# EAGLE board PART1 (EAGLE 9.6.2)
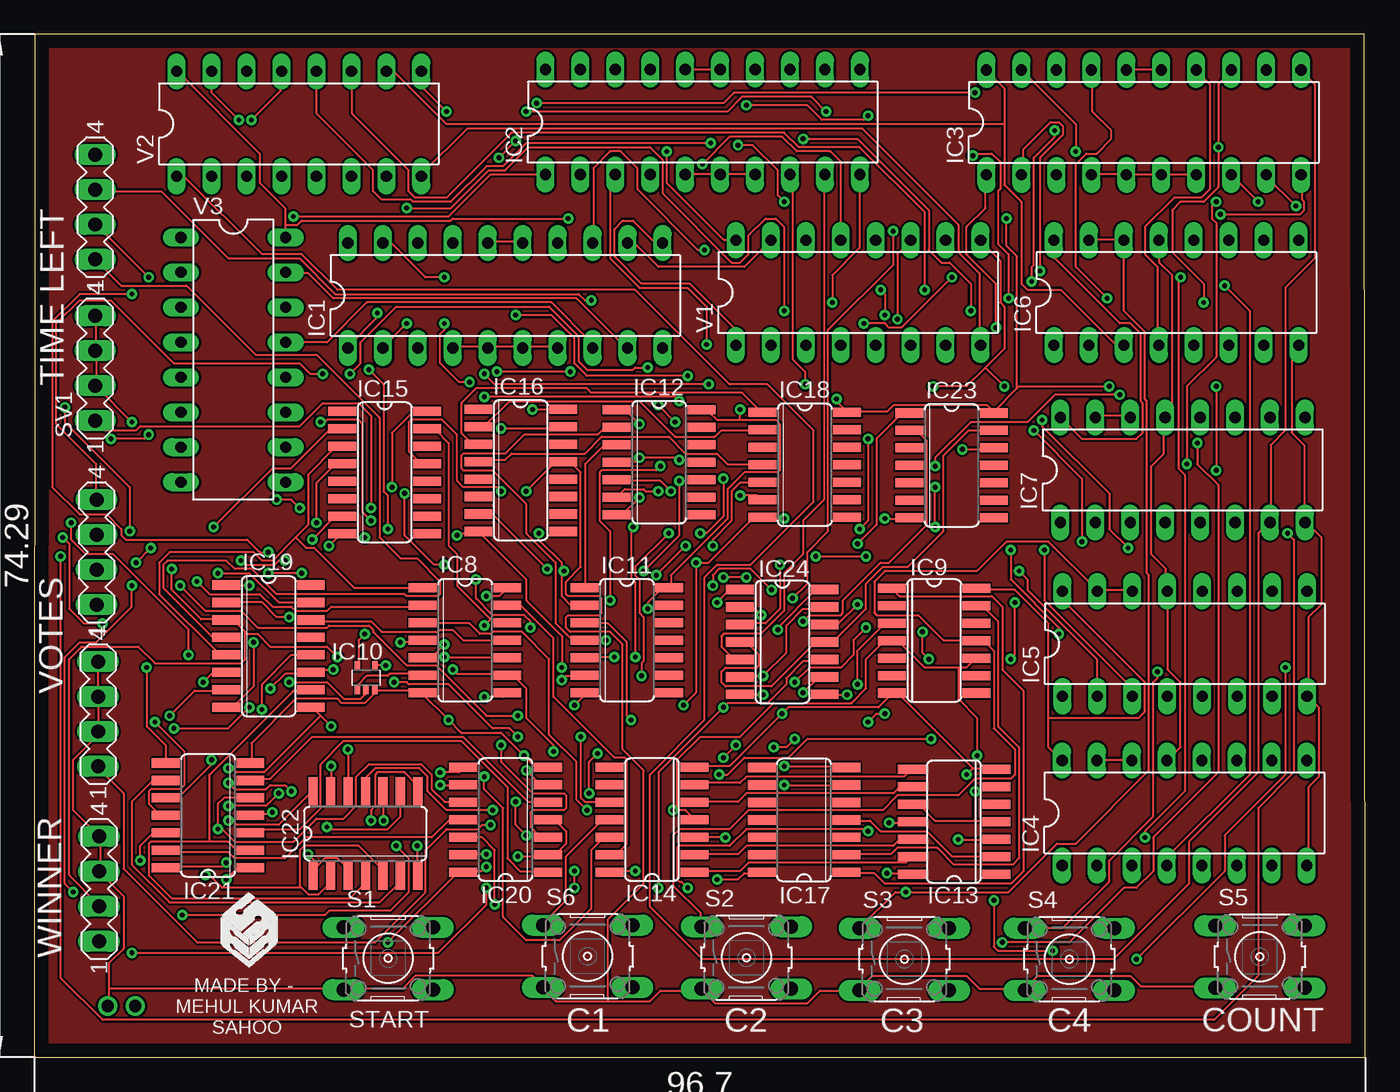
[diagram p1: board, top side]
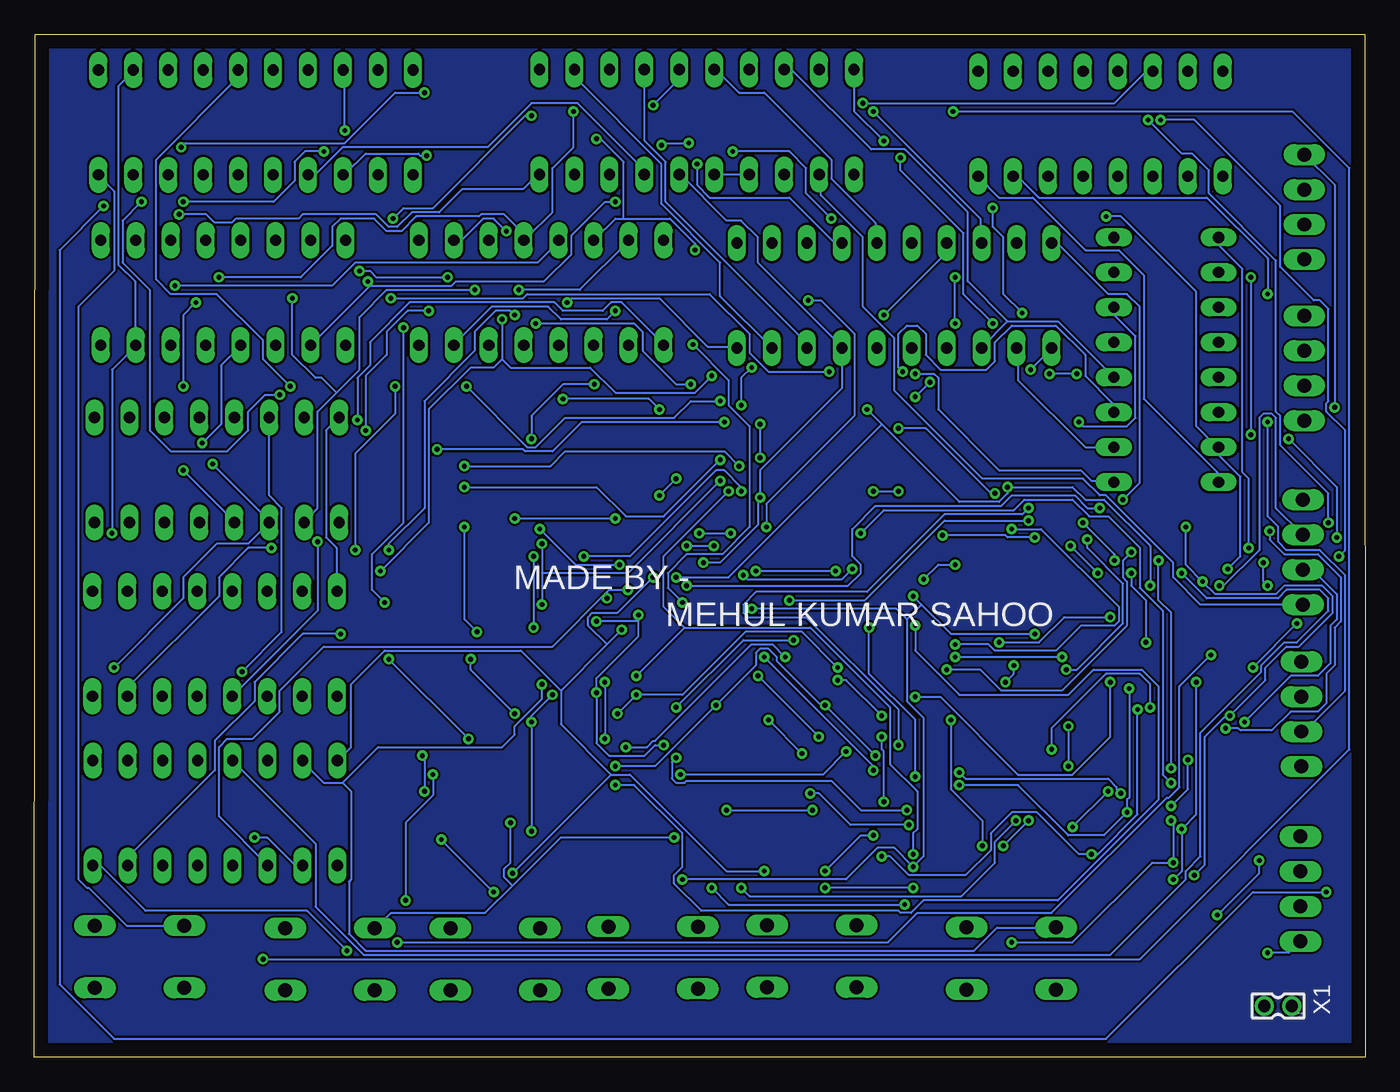
[diagram p2: board, bottom side, seen from below]

Size 96.7 x 74.31 mm. Coordinates in mm from the lower left corner, seen from the top.
Outline: 0,0 96.7,0 96.62,74.31 0.03,74.31 0,0
Copper layers (1*16): Top 0.035mm / dielectric 1.5mm / Bottom 0.035mm
Design rules "default": minimum track width 6mil, minimum drill 0.35mm, track to track 6mil, track to pad 6mil, pad to pad 6mil, via to via 6mil, smd to smd 6mil, copper to edge 40mil, drill to drill 6mil, minimum pad ring 10mil, minimum via ring 8mil, stop-mask expansion 4mil, vias tented up to drill 0mil, thermal gap 10mil

## Footprints (pad centres in the part's own frame; a part is rotated, then mirrored left to right if it is on the bottom)
DIL20 = drill 0.813 long: 1 -11.43,-3.81; 2 -8.89,-3.81; 3 -6.35,-3.81; 4 -3.81,-3.81; 5 -1.27,-3.81; 6 1.27,-3.81; 7 3.81,-3.81; 8 6.35,-3.81; 9 8.89,-3.81; 10 11.43,-3.81; 11 11.43,3.81; 12 8.89,3.81; 13 6.35,3.81; 14 3.81,3.81; 15 1.27,3.81; 16 -1.27,3.81; 17 -3.81,3.81; 18 -6.35,3.81; 19 -8.89,3.81; 20 -11.43,3.81
DIL16 = drill 0.813 long: 1 -8.89,-3.81; 2 -6.35,-3.81; 3 -3.81,-3.81; 4 -1.27,-3.81; 5 1.27,-3.81; 6 3.81,-3.81; 7 6.35,-3.81; 8 8.89,-3.81; 9 8.89,3.81; 10 6.35,3.81; 11 3.81,3.81; 12 1.27,3.81; 13 -1.27,3.81; 14 -3.81,3.81; 15 -6.35,3.81; 16 -8.89,3.81
SO14 = smd 0.66 x 2.032: 1 -3.81,-3.073; 2 -2.54,-3.073; 3 -1.27,-3.073; 4 0,-3.073; 5 1.27,-3.073; 6 2.54,-3.073; 7 3.81,-3.073; 8 3.81,3.073; 9 2.54,3.073; 10 1.27,3.073; 11 0,3.073; 12 -1.27,3.073; 13 -2.54,3.073; 14 -3.81,3.073
SC70-5 = smd 0.4 x 0.7: 1 -0.65,-0.85; 2 0,-0.85; 3 0.65,-0.85; 4 0.65,0.85; 5 -0.65,0.85
SO16 = smd 0.66 x 2.032: 1 -4.445,-3.073; 2 -3.175,-3.073; 3 -1.905,-3.073; 4 -0.635,-3.073; 5 0.635,-3.073; 6 1.905,-3.073; 7 3.175,-3.073; 8 4.445,-3.073; 9 4.445,3.073; 10 3.175,3.073; 11 1.905,3.073; 12 0.635,3.073; 13 -0.635,3.073; 14 -1.905,3.073; 15 -3.175,3.073; 16 -4.445,3.073
B3F-10XX = drill 1.016 long: 1 -3.251,2.261; 2 3.251,2.261; 3 -3.251,-2.261; 4 3.251,-2.261
MA04-1 = drill 1.016 long: 1 -3.81,0; 2 -1.27,0; 3 1.27,0; 4 3.81,0
332-02 = drill 0.9 pad 1.27: 1 0,-1; 2 0,1

## Placement (x,y rotation side)
IC1  74AC11257  [DIL20]  34.21,55.35 0 top
IC2  74AC11257  [DIL20]  48.56,67.94 0 top
IC3  74AC11257  [DIL20]  80.62,67.92 0 top
IC4  4017N  [DIL16]  83.57,17.75 0 top
IC5  4017N  [DIL16]  83.59,30.05 0 top
IC6  4017N  [DIL16]  82.98,55.55 0 top
IC7  4017N  [DIL16]  83.44,42.67 0 top
IC8  74AC08D  [SO14]  31.29,30.3 270 top
IC9  4013D  [SO14]  65.38,30.28 270 top
IC10  74AHC1G32DCK  [SC70-5]  24.1,27.58 0 top
IC11  74AC08D  [SO14]  43.05,30.3 270 top
IC12  74AC32D  [SO14]  45.39,43.23 270 top
IC13  4013D  [SO14]  66.83,17.12 90 top
IC14  4013D  [SO14]  44.88,17.27 90 top
IC15  4017D  [SO16]  25.45,42.49 270 top
IC16  4017D  [SO16]  35.33,42.65 270 top
IC17  74HC25D  [SO14]  55.93,17.25 90 top
IC18  74AC21D  [SO14]  55.98,43.05 270 top
IC19  4049D  [SO16]  17.02,29.87 270 top
IC20  74AC08D  [SO14]  34.24,17.27 90 top
IC21  74AC32D  [SO14]  12.62,17.58 90 top
IC22  74AC11D  [SO14]  24.05,16.26 0 top
IC23  74AC11D  [SO14]  66.65,43 270 top
IC24  4069D  [SO14]  54.36,30.18 270 top
S1  [B3F-10XX]  25.7,7.19 0 top
S2  [B3F-10XX]  51.74,7.24 0 top
S3  [B3F-10XX]  63.22,7.14 0 top
S4  [B3F-10XX]  75.21,7.14 0 top
S5  [B3F-10XX]  89.05,7.32 0 top
S6  [B3F-10XX]  40.21,7.34 0 top
SV1  [MA04-1]  4.42,50.06 90 top
SV2  [MA04-1]  4.42,61.77 90 top
SV3  [MA04-1]  4.52,36.7 90 top
SV4  [MA04-1]  4.62,24.94 90 top
SV5  [MA04-1]  4.7,12.24 90 top
V1  7485AN  [DIL16]  59.87,55.55 0 top
V2  7485AN  [DIL16]  19.23,67.82 0 top
V3  7485AN  [DIL16]  14.45,50.67 270 top
X1  332-02  [332-02]  6.32,3.73 90 bottom

## Tracks (layer width: path | path; a pad name or v marks a point on that pad's centre or on a via)
+UB  (via drill 0.35)
  Top 0.152: 18.21,60.48 18.21,61.7 16.38,63.53 16.38,65.66 10.44,71.6 V2.16 | 18.21,60.48 18.21,59.56 V3.16 | v45.95,65.81 45.95,63.53 50.06,59.41 50.98,59.41 V1.16 | v38.79,60.93 30.4,60.93 30.25,60.78 19.43,60.78 19.13,60.48 18.21,60.48
  Bottom 0.152: v45.95,65.81 41.83,65.81 40.61,64.59 40.61,62.76 v38.79,60.93
-UB
  Top 0.152: V1.8 68.66,51.79 68.66,56.97 67.13,58.5 67.13,60.48 60.12,67.49 31.47,67.49 28.12,64.14 V2.8
  Bottom 0.152: V3.8 10.74,41.88 10.74,42.49 16.08,47.83 16.08,56.82 17.91,58.65 20.35,58.65 24.16,62.46 26.59,62.46 28.12,63.98 V2.8
GND  (via drill 0.35)
  Top 0.152: 24.92,26.64 27.97,26.64 28.12,26.49 | 24.92,26.64 24.76,26.64 IC10.3 24.92,26.64 | 24.92,26.64 24,25.73 22.33,25.73 22.02,26.04 18.97,26.04 15.77,22.83 15.77,21.46 IC21.7 | v27.81,15.37 27.81,13.23 IC22.7 | 28.12,26.49 v30.1,24.51 31.01,23.6 33.91,23.6 v35.59,21.92 36.35,21.16 37.26,21.16 IC20.7 | 28.12,26.49 IC8.7 | v39.24,25.58 39.85,26.19 39.85,26.49 IC11.7 | v54.48,21.16 58.9,21.16 IC17.7 | IC3.4 76.89,64.14 79.32,64.14 IC3.5 79.48,64.14 81.76,64.14 IC3.6 81.91,64.14 84.35,64.14 IC3.7 | IC2.7 IC2.6 IC2.5 | IC1.4 30.4,51.64 32.84,51.64 IC1.5 32.99,51.64 35.43,51.64 IC1.6 35.59,51.64 38.02,51.64 IC1.7 | v43.97,40.67 42.75,39.45 42.44,39.45 IC12.7 | v61.8,39.14 63.47,39.14 IC23.7 | v54.48,39.14 52.96,39.14 IC18.7 52.81,39.14 52.2,39.14 49,35.94 v48.08,35.94 48.08,26.49 v47.17,25.58
  Bottom 0.152: v27.81,15.37 27.81,17.2 30.1,19.48 v30.1,24.51 | v35.59,21.92 v39.24,25.58 39.55,25.58 42.75,28.78 42.75,29.08 43.36,29.69 43.97,29.69 44.27,29.39 44.27,28.47 v47.17,25.58 51.59,21.16 v54.48,21.16 | IC2.5 IC2.4 | v48.08,35.94 46.86,35.94 44.12,38.68 44.12,40.51 v43.97,40.67 43.97,42.65 38.02,48.59 IC1.7 38.02,51.64 44.12,57.73 44.12,59.56 45.34,60.78 46.41,60.78 49.76,64.14 IC2.6 | v54.48,39.14 v61.8,39.14 | IC3.4 76.73,64.14 76.28,64.14 74.29,66.12 63.78,66.12 60.58,69.32 57.23,69.32 52.5,64.59 52.5,64.14 IC2.7
N$1
  Top 0.152: IC13.2 69.88,14.61 66.67,14.61 64.85,16.43 61.49,16.43 60.73,17.2 59.05,17.2 IC17.4
N$2  (via drill 0.35)
  Top 0.152: v17.6,40.51 18.67,40.51 v19.28,39.9 | v49.3,34.26 49.3,35.03 49.76,35.48 52.04,35.48 v53.57,33.96 | v62.41,60.02 62.41,57.58 57.68,52.86 57.68,38.23 56.16,36.7 56.16,34.42 v55.09,33.35
  Bottom 0.152: v17.6,40.51 16.38,41.73 16.38,54.53 17.3,55.45 18.67,55.45 22.33,59.11 22.78,59.11 IC1.20 | v19.28,39.9 20.19,39.9 21.11,40.82 25.68,40.82 26.44,40.06 35.59,40.06 37.26,38.38 37.26,36.4 36.65,35.79 36.65,35.18 37.57,34.26 v49.3,34.26 | v53.57,33.96 54.94,33.96 55.09,33.81 | 55.09,33.81 59.05,29.85 75.67,29.85 78.87,26.64 78.87,25.12 80.85,23.14 82.68,23.14 83.29,22.53 83.29,17.5 79.78,14 IC4.3 | v62.41,60.02 63.32,60.93 64.08,60.93 65.61,59.41 66.22,59.41 V1.10 | 55.09,33.81 v55.09,33.35
N$3
  Top 0.152: IC5.14 79.78,33.96 77.34,33.96 IC5.15 77.19,33.96 73.69,37.47 70.64,37.47 68.5,35.33 61.8,35.33 61.04,34.57 61.04,32.28 61.19,32.13 64.24,32.13 66.07,30.3 68.35,30.3 IC9.11 68.5,30.15 69.11,30.15 69.72,29.54 69.72,23.9 71.25,22.38 71.25,20.55 70.94,20.24 68.35,20.24 67.13,19.02 62.71,19.02 61.65,17.96 51.89,17.96 50.52,16.59 46.86,16.59 46.41,16.13 46.41,12.47 48.39,10.49 48.39,9.58 S2.1
N$4  (via drill 0.35)
  Top 0.152: IC6.15 76.73,59.41 79.17,59.41 IC6.14 79.17,54.23 80.7,52.71 80.7,47.83 80.85,47.68 80.85,35.18 81,35.03 81,20.85 75.67,15.52 74.29,15.52 70.79,12.01 v63.32,12.01 62.56,12.01 59.97,9.42 S3.1 | v67.13,15.82 69.88,15.82 IC13.3
  Bottom 0.152: v63.32,12.01 v67.13,15.82
N$5  (via drill 0.35)
  Top 0.152: v35.74,68.71 50.37,68.71 51.43,69.77 56.46,69.77 v57.53,68.71 | v80.7,15.98 80.7,16.43 83.59,19.33 83.59,42.34 83.13,42.8 83.13,56.52 v83.29,56.67
  Bottom 0.152: v35.74,68.71 27.97,60.93 27.97,59.26 IC1.18 | v57.53,68.71 57.53,66.12 59.05,64.59 59.05,61.39 60.88,59.56 | 60.88,59.56 61.04,59.41 V1.12 60.88,59.56 | v80.7,15.98 79.78,15.98 77.8,14 77.34,14 IC4.2 | v83.29,56.67 77.34,56.67 75.06,58.95 75.06,60.33 74.45,60.93 72.01,60.93 71.09,60.02 70.03,60.02 68.96,61.09 64.39,61.09 64.24,61.24 62.56,61.24 60.88,59.56
N$6  (via drill 0.35)
  Top 0.152: v86.49,56.06 88.32,54.23 88.32,20.55 82.37,14.61 82.37,14 IC4.4 | v48.54,64.9 50.52,66.88 54.33,66.88 55.4,65.81 57.84,65.81 58.6,65.05 V1.13
  Bottom 0.152: v86.49,56.06 75.06,56.06 73.38,57.73 60.12,57.73 58.6,59.26 V1.13 | v48.54,64.9 48.54,63.37 47.62,62.46 41.83,62.46 38.63,59.26 38.02,59.26 IC1.14
N$7  (via drill 0.35)
  Top 0.152: IC6.13 81.76,59.26 81.76,57.73 82.68,56.82 82.68,47.07 82.22,46.61 IC7.13 82.07,46.46 82.07,43.87 81.15,42.95 81.15,36.55 82.22,35.48 82.22,33.96 IC5.13 82.37,33.81 82.37,28.17 83.29,27.25 83.29,22.53 82.37,21.62 IC4.13 | IC19.15 17.75,33.05 15.62,35.18 v13.33,35.18
  Bottom 0.152: v13.33,35.18 11.51,33.35 6.32,33.35 5.71,33.96 3.28,33.96 2.67,33.35 2.67,32.44 4.95,30.15 5.87,30.15 7.54,28.47 7.54,28.02 11.96,23.6 11.96,14.61 13.03,13.54 13.03,12.93 18.52,7.44 72.77,7.44 76.28,10.95 76.28,15.52 82.22,21.46 IC4.13
N$8  (via drill 0.35)
  Top 0.152: V1.15 51.59,57.43 45.34,57.43 43.66,59.11 43.21,59.11 IC1.12 | v74.45,30.76 74.45,31.22 70.94,34.72 v70.94,36.86 | v61.8,53.92 61.8,55.45 v61.49,55.75
  Bottom 0.152: v74.45,30.76 77.19,30.76 80.7,27.25 80.7,25.88 83.59,22.99 83.59,20.85 89.84,14.61 89.84,14 IC4.7 | v70.94,36.86 70.94,37.31 68.35,39.9 68.35,47.68 64.69,51.33 64.69,52.71 63.17,54.23 62.1,54.23 v61.8,53.92 | v61.49,55.75 57.07,55.75 53.57,59.26 V1.15
N$9  (via drill 0.35)
  Top 0.152: v29.79,56.67 28.42,56.67 25.98,59.11 25.37,59.11 IC1.19 | v29.79,53.31 29.79,52.86 29.49,52.55 29.49,50.42 30.86,49.05 v31.62,49.05 | v32.69,47.98 46.56,47.98 v46.86,47.68 | v65.3,48.74 67.74,48.74 69.11,50.11 | 69.11,50.11 70.48,51.49 70.48,54.53 70.18,54.84 70.18,57.89 68.81,59.26 V1.9 | IC5.3 79.78,26.8 73.38,33.2 v73.38,36.86 | 69.11,50.11 v70.48,48.74
  Bottom 0.152: v29.79,53.31 v29.79,56.67 | v32.69,47.98 v31.62,49.05 | v46.86,47.68 49,47.68 50.22,46.46 58.14,46.46 60.27,44.32 60.88,44.32 v65.3,48.74 | v73.38,36.86 73.38,43.87 70.48,46.76 v70.48,48.74
N$10  (via drill 0.35)
  Top 0.152: v71.55,35.33 72.16,34.72 72.16,33.96 77.19,28.93 77.19,26.34 IC5.2 | v62.71,53.62 62.71,58.34 63.63,59.26 V1.11 | v34.98,53.92 37.57,53.92 39.24,52.25 39.24,50.42 40.16,49.5 v47.47,49.5
  Bottom 0.152: v71.55,35.33 68.05,38.84 68.05,47.07 65,50.11 63.32,50.11 62.71,50.72 | v62.71,53.62 62.71,50.72 | IC1.17 30.4,58.5 v34.98,53.92 | v47.47,49.5 48.69,48.29 54.48,48.29 56.31,50.11 62.1,50.11 62.71,50.72
N$11  (via drill 0.35)
  Top 0.152: v48.69,58.65 48.23,58.65 43.81,63.07 43.81,64.59 42.6,65.81 41.83,65.81 40.61,64.59 40.61,59.26 IC1.13 | v76.12,37.47 76.12,42.04 v72.62,45.54 | v68.05,54.23 68.05,56.21 66.52,57.73 65.91,57.73 65,58.65 65,61.54 59.82,66.73 v55.85,66.73
  Bottom 0.152: v48.69,58.65 48.69,59.11 50.52,60.93 53.87,60.93 | 53.87,60.93 54.48,60.93 V1.14 | IC5.4 76.12,32.44 v76.12,37.47 | v72.62,45.54 72.62,49.5 71.09,51.03 71.09,52.71 69.57,54.23 v68.05,54.23 | v55.85,66.73 55.55,66.73 53.87,65.05 53.87,60.93
N$12  (via drill 0.35)
  Top 0.152: v79.48,37.01 78.1,38.38 78.1,40.97 73.23,45.85 v73.23,46.3 | V1.1 50.98,52.86 47.62,56.21 44.12,56.21 42.14,58.19 42.14,60.17 42.75,60.78 43.51,60.78 45.03,59.26 45.64,59.26 IC1.11
  Bottom 0.152: v79.48,37.01 81.15,37.01 83.29,34.87 83.29,33.5 89.84,26.95 89.84,26.34 IC5.7 | v73.23,46.3 73.23,49.35 72.31,50.27 72.31,51.94 69.42,54.84 58.9,54.84 58.29,54.23 55.4,54.23 54.79,54.84 54.03,54.84 50.98,51.79 V1.1
N$13
  Top 0.152: IC3.11 92.13,71.6 93.04,70.69 93.04,58.04 90.91,55.91 90.91,45.54 89.84,44.48 89.84,38.99 IC7.7 89.69,38.84 88.93,38.07 88.93,20.7 83.9,15.67 83.9,12.62 78.41,7.14 48.54,7.14 44.73,10.95 44.73,20.55 48.69,24.51 48.69,34.87 49.61,35.79 52.04,35.79 56.62,40.36 56.62,45.54 53.26,48.9 50.52,48.9 43.66,55.75 22.02,55.75 19.43,58.34 16.54,58.34 10.9,63.98 10.44,63.98 V2.1
N$14  (via drill 0.35)
  Top 0.152: v57.99,54.84 57.99,56.82 59.97,58.8 59.97,64.14 IC2.10 | v86.18,61.24 91.97,61.24 92.28,61.54 92.28,62.15 92.13,62.31 92.13,63.98 IC3.10
  Bottom 0.152: v57.99,54.84 57.68,55.14 51.28,55.14 47.78,51.64 45.64,51.64 IC1.10 | v86.18,61.24 84.2,61.24 83.59,60.63 82.37,60.63 82.07,60.93 77.5,60.93 77.19,61.24 71.86,61.24 70.94,60.33 70.33,60.33 69.27,61.39 67.28,61.39 65.61,63.07 61.19,63.07 60.12,64.14 IC2.10 | S5.1 89.99,9.58 92.74,12.32 92.89,12.32 93.5,12.93 93.5,54.53 90.91,57.12 90.91,62.92 91.97,63.98 IC3.10
N$15  (via drill 0.35)
  Top 0.152: v33.76,65.35 v34.98,66.57 | v27.05,53.31 25.37,51.64 IC1.2
  Bottom 0.152: V3.10 20.35,44.32 25.22,49.2 25.22,51.49 IC1.2 | v34.98,66.57 37.11,68.71 37.11,71.76 IC2.20 | v33.76,65.35 33.76,64.44 29.18,59.87 29.18,55.45 v27.05,53.31
N$16
  Bottom 0.152: V3.12 22.33,53.47 25.98,53.47 | 25.98,53.47 27.81,51.64 IC1.3 | IC2.18 41.68,71.76 35.89,65.96 33.45,65.96 28.88,61.39 28.88,56.36 25.98,53.47
N$17
  Top 0.152: 70.48,67.79 70.48,70.38 69.27,71.6 IC3.20 | 70.48,67.79 70.48,63.37 71.7,62.15 71.7,56.21 72.16,55.75 74.6,55.75 78.56,51.79 79.17,51.79 IC6.3 | 70.48,67.79 29.95,67.79 26.14,71.6 25.68,71.6 V2.10
N$18  (via drill 0.35)
  Top 0.152: V2.12 20.5,68.55 24.61,64.44 24.61,62.92 25.22,62.31 27.36,62.31 27.51,62.15 30.25,62.15 32.84,64.74 34.06,64.74 35.74,66.42 v49.15,66.42 | v51.13,66.27 52.2,66.27 54.03,64.44 54.03,62.61 v54.48,62.15 | v74.14,67.34 74.14,66.88 72.62,65.35 72.62,57.58 72.47,57.43 v72.47,56.36
  Bottom 0.152: v49.15,66.42 50.98,66.42 v51.13,66.27 | v54.48,62.15 55.24,62.15 57.68,59.72 57.68,58.34 59.66,56.36 66.07,56.36 66.37,56.06 72.16,56.06 | 72.16,56.06 72.31,56.06 IC6.2 | v74.14,67.34 74.14,71.6 IC3.18 | 72.16,56.06 v72.47,56.36
N$19  (via drill 0.35)
  Top 0.152: IC6.4 81.61,51.79 81.61,57.43 80.7,58.34 80.7,60.33 82.83,62.46 84.81,62.46 85.42,63.07 85.42,70.69 84.51,71.6 IC3.14 | v15.77,68.1 17.91,70.23 17.91,71.6 V2.13 | v2.67,38.84 2.67,37.62 3.73,36.55 5.71,36.55 11.2,31.06 v11.2,29.24 | v70.33,8.36 75.21,8.36 79.17,12.32 80.09,12.32 81.31,13.54 81.31,15.98 86.03,20.7 86.03,41.58 84.51,43.1 v84.51,44.63
  Bottom 0.152: v15.77,68.1 13.33,65.66 12.57,65.66 11.35,64.44 11.35,62.76 6.48,57.89 6.48,46.91 6.17,46.61 6.17,44.48 2.67,40.97 v2.67,38.84 | v11.2,29.24 13.49,26.95 13.49,19.63 14.25,18.87 14.4,18.87 22.78,10.49 32.54,10.49 34.67,8.36 v70.33,8.36 | v84.51,44.63 83.13,46 83.13,50.27 81.76,51.64 IC6.4
N$20  (via drill 0.35)
  Top 0.152: V2.15 12.88,70.08 v14.86,68.1 | v1.9,36.4 1.9,5.77 4.95,2.72 85.72,2.72 88.93,5.92 88.93,18.11 91.52,20.7 91.52,37.62 v91.06,38.07
  Bottom 0.152: IC3.12 89.53,71.6 90.6,70.54 90.6,57.58 89.38,56.36 89.38,51.79 IC6.7 89.38,51.64 91.06,49.96 v91.06,38.07 | v14.86,68.1 12.42,68.1 6.17,61.85 6.17,57.43 3.73,54.99 3.28,54.99 2.67,54.38 2.67,47.68 2.82,47.52 2.82,46.91 1.45,45.54 1.45,36.86 v1.9,36.4
N$21  (via drill 0.35)
  Top 0.152: v83.74,43.1 83.74,48.74 85.88,50.88 85.88,60.63 85.57,60.93 85.57,61.85 v85.88,62.15 | v75.67,65.81 75.67,67.79 IC3.19 | V2.9 28.12,70.54 v29.95,68.71 | v80.09,7.14 86.49,13.54 86.49,16.13 90.91,20.55 v90.91,28.32
  Bottom 0.152: v83.74,43.1 79.63,38.99 IC7.3 79.63,38.84 81.15,37.31 83.44,37.31 85.88,34.87 85.88,33.35 v90.91,28.32 | v85.88,62.15 79.32,62.15 77.8,63.68 77.8,65.05 77.04,65.81 v75.67,65.81 | v29.95,68.71 5.26,68.71 1.14,64.59 1.14,22.38 16.38,7.14 v80.09,7.14
N$22  (via drill 0.35)
  Top 0.152: v64.69,55.75 64.69,61.39 59.97,66.12 55.55,66.12 54.48,67.18 34.67,67.18 29.95,62.46 27.66,62.46 27.2,62.92 27.2,64.44 23.09,68.55 23.09,71.6 V2.11 | v77.95,55.14 75.67,57.43 75.67,64.9 76.43,65.66 77.19,65.66 78.26,66.73 78.26,67.34 76.89,68.71 76.89,71.6 IC3.17
  Bottom 0.152: v64.69,55.75 71.09,55.75 73.08,53.77 73.08,49.96 74.75,48.29 | 74.75,48.29 76.12,46.91 76.12,39.9 77.04,38.99 IC7.2 | v77.95,55.14 77.95,51.03 76.28,49.35 75.82,49.35 74.75,48.29
N$23  (via drill 0.35)
  Top 0.152: v85.88,48.74 v85.88,42.65 | v84.96,54.84 84.96,56.21 82.68,58.5 82.68,61.54 83.29,62.15 84.96,62.15 86.03,63.22 v86.03,66.12 86.03,70.69 86.94,71.6 IC3.13 | v36.5,69.32 50.06,69.32 50.83,70.08 v68.35,70.08
  Bottom 0.152: v85.88,42.65 82.22,38.99 IC7.4 | v85.88,48.74 85.88,53.92 v84.96,54.84 | v36.5,69.32 18.21,69.32 15.93,71.6 15.47,71.6 V2.14 | v68.35,70.08 70.48,70.08 74.14,66.42 85.72,66.42 v86.03,66.12
N$24
  Top 0.152: V3.13 21.26,51.94 24.16,54.84 37.57,54.84 40.46,51.94 40.46,51.64 IC1.8
  Bottom 0.152: IC2.14 52.35,71.76 52.35,66.57 50.83,65.05 50.83,62.15 40.61,51.94 40.61,51.64 IC1.8
N$25  (via drill 0.35)
  Top 0.152: 15.32,30.76 15.32,28.93 15.01,28.63 8.76,28.63 7.54,29.85 3.43,29.85 2.51,28.93 2.51,13.23 4.65,11.1 SV5.2 | 15.32,30.76 15.32,30.91 14.55,31.67 13.94,31.67 IC19.3 13.94,31.83 12.12,31.83 9.98,33.96 v9.98,35.48 | v29.79,29.08 34.37,29.08 IC8.10 | v22.02,29.08 21.26,29.85 17.14,29.85 16.23,30.76 15.32,30.76 | IC2.1 33.15,64.14 30.1,61.09 v18.82,61.09
  Bottom 0.152: v22.02,29.08 v29.79,29.08 | v9.98,35.48 9.07,36.4 9.07,42.19 10.59,43.71 10.59,44.32 V3.7 10.74,44.32 12.27,45.85 12.27,55.6 17.75,61.09 v18.82,61.09
N$26  (via drill 0.35)
  Top 0.152: v7.39,35.94 v8.46,37.01 | v7.09,34.26 7.09,32.74 4.5,30.15 3.28,30.15 2.21,29.08 2.21,12.62 v2.82,12.01 | v91.67,61.85 89.53,63.98 IC3.9
  Bottom 0.152: v8.46,37.01 8.46,42.04 8.92,42.49 8.92,57.28 10.59,58.95 10.59,59.56 V3.1 | v7.39,35.94 7.39,34.57 v7.09,34.26 | v2.82,12.01 8.15,12.01 18.82,1.35 90.91,1.35 94.87,5.31 94.87,58.65 v91.67,61.85
N$27  (via drill 0.35)
  Top 0.152: v20.8,46.15 21.11,46.15 21.26,46.3 23.55,46.3 23.85,46 23.85,39.6 v24.46,38.99 | v41.83,33.2 41.83,38.23 41.07,38.99 41.07,42.49 41.22,42.65 45.19,42.65 v45.49,42.95 | v65.46,42.95 65.46,43.56 68.05,46.15 72.16,46.15 74.14,48.13 v78.87,48.13 | IC3.8 v88.93,62.15
  Bottom 0.152: v20.8,46.15 20.5,45.85 17.3,45.85 16.69,46.46 16.69,52.4 18.21,53.92 18.21,54.38 V3.14 | v24.46,38.99 30.56,38.99 36.35,33.2 v41.83,33.2 | v45.49,42.95 46.56,44.02 58.14,44.02 59.21,42.95 v65.46,42.95 | v78.87,48.13 79.93,48.13 81.15,46.91 81.15,45.54 82.68,44.02 86.79,44.02 88.32,45.54 88.32,55.75 90.3,57.73 90.3,60.78 v88.93,62.15
N$28  (via drill 0.35)
  Top 0.152: v38.94,49.81 v33.6,49.81 | v70.79,55.14 70.79,58.34 70.03,59.11 70.03,62.92 70.18,63.07 70.18,65.05 69.57,65.66 68.35,65.66 v68.2,65.51
  Bottom 0.152: v33.6,49.81 33.91,50.11 33.91,52.55 33.3,53.16 32.54,53.16 31.93,52.55 31.93,51.03 30.86,49.96 27.51,49.96 26.9,50.57 26.9,51.94 25.68,53.16 22.48,53.16 20.35,51.03 20.35,49.5 18.36,47.52 18.36,46.91 V3.11 | v38.94,49.81 43.36,49.81 44.73,51.18 44.73,52.55 47.62,55.45 60.88,55.45 61.19,55.14 v70.79,55.14 | v68.2,65.51 68.66,65.51 68.81,65.66 72.62,65.66 74.14,64.14 IC3.3
N$29  (via drill 0.35)
  Top 0.152: v29.79,30 28.88,29.08 28.27,29.08 IC8.5 | v25.68,38.38 25.68,40.82 25.37,41.12 25.37,48.9 v24.31,49.96 | v54.48,54.23 54.48,60.33 53.87,60.93 53.11,60.93 51.89,59.72 51.89,58.34 51.28,57.73 50.67,57.73 45.64,62.76 45.64,65.2 44.73,66.12 35.89,66.12 34.21,64.44 32.99,64.44 30.25,61.7 v27.05,61.7 | v24.92,54.08 24.92,53.77 22.78,51.64 IC1.1
  Bottom 0.152: v29.79,30 27.36,30 26.9,29.54 22.48,29.54 20.65,31.37 18.21,31.37 17.91,31.67 17.91,32.74 23.55,38.38 v25.68,38.38 | v24.31,49.96 22.78,51.49 IC1.1 | v54.48,54.23 55.09,53.62 58.45,53.62 59.36,54.53 63.47,54.53 66.22,51.79 V1.7 | v27.05,61.7 27.05,60.33 26.29,59.56 26.29,55.45 v24.92,54.08
N$30  (via drill 0.35)
  Top 0.152: v30.4,28.17 30.71,27.86 34.37,27.86 IC8.9 34.37,27.71 34.82,27.71 35.74,26.8 35.74,24.66 37.72,22.68 v37.72,22.23 | v16.99,36.7 16.38,36.7 15.47,37.62 6.63,37.62 6.32,37.92 6.32,38.38 5.26,39.45 3.28,39.45 1.3,41.43 1.3,53.47 3.28,55.45 v7.09,55.45 | v69.88,53.01 69.88,56.21 67.74,58.34 67.74,60.33 69.11,61.7 69.11,63.98 IC3.1 | v71.25,33.05 71.25,29.24 v70.94,28.93 | v65.15,23.14 56.16,23.14 54.79,21.77 51.59,21.77 50.37,20.55 v49.76,20.55
  Bottom 0.152: v30.4,28.17 27.97,28.17 26.44,26.64 22.02,26.64 17.3,31.37 17.3,34.57 17.6,34.87 17.6,36.09 v16.99,36.7 | v7.09,55.45 7.09,58.04 11.51,62.46 23.7,62.46 25.22,63.98 25.53,63.98 V2.7 | v69.88,53.01 69.88,38.84 72.16,36.55 72.16,33.96 v71.25,33.05 | v65.15,23.14 v70.94,28.93 | v49.76,20.55 39.4,20.55 v37.72,22.23
N$31  (via drill 0.35)
  Top 0.152: v32.69,49.66 33.45,48.9 v49,48.9 | v60.27,53.31 61.8,53.31 62.1,53.01 63.02,53.01 v66.67,56.67 | v73.08,57.12 73.08,65.35 74.75,67.03 74.75,67.64 74.45,67.95 73.84,67.95 71.86,65.96 71.86,64.14 IC3.2
  Bottom 0.152: v32.69,49.66 31.32,49.66 31.01,49.35 31.01,47.07 26.59,42.65 20.65,42.65 19.89,41.88 18.36,41.88 V3.9 | v49,48.9 50.06,48.9 52.5,51.33 52.5,52.71 53.11,53.31 v60.27,53.31 | v66.67,56.67 71.86,56.67 72.31,57.12 v73.08,57.12
N$32  (via drill 0.35)
  Top 0.152: IC19.2 16.54,33.05 17.6,31.98 v18.52,31.98 | v26.59,30.15 27.97,30.15 28.12,30.3 IC8.4
  Bottom 0.152: v18.52,31.98 21.87,31.98 23.7,30.15 v26.59,30.15
N$33  (via drill 0.35)
  Top 0.152: v18.52,27.25 21.26,27.25 22.48,26.04 23.7,26.04 24,26.34 24,26.64 IC10.2 | v32.69,26.19 34.06,26.19 IC8.8
  Bottom 0.152: v18.52,27.25 18.52,23.29 21.26,20.55 25.22,20.55 30.86,26.19 v32.69,26.19
N$34
  Top 0.152: IC10.1 23.55,26.8 23.55,27.1 24.16,27.71 25.68,27.71 25.83,27.86 28.12,27.86 IC8.6
N$35  (via drill 0.35)
  Top 0.152: v25.53,28.47 24.76,28.47 IC10.4 | v26.14,27.25 27.05,27.25 27.2,27.1 30.1,27.1 33.3,23.9 34.52,23.9 v35.13,23.29 | v34.98,18.57 34.98,16.89 v35.74,16.13 | v39.24,12.32 v39.24,13.54 | v32.84,12.32 32.84,11.1 29.34,7.59 v7.09,7.59
  Bottom 0.152: v25.53,28.47 25.53,27.86 v26.14,27.25 | v35.13,23.29 35.13,22.38 34.98,22.23 v34.98,18.57 | v35.74,16.13 36.65,16.13 v39.24,13.54 | v32.84,12.32 v39.24,12.32 | v7.09,7.59 5.56,7.59 4.8,8.36 SV5.1
N$36
  Top 0.152: V3.15 18.36,56.97 19.89,56.97 21.72,55.14 39.4,55.14 43.05,51.49 IC1.9
  Bottom 0.152: IC1.9 46.86,55.3 46.86,57.73 51.13,62 51.13,64.9 57.38,71.15 57.38,71.76 IC2.12
N$37
  pour Top: 0,0.08 0.08,0 96.7,0 96.7,74.27 96.72,74.3 0.05,74.3 0,74.24
N$38  (via drill 0.35)
  Top 0.152: v33.3,17.96 29.95,17.96 28.57,19.33 28.57,20.4 27.97,21.01 24.76,21.01 24.16,20.4 24.16,19.33 IC22.11 | v50.98,22.68 v50.06,21.77 | v55.85,26.49 56.92,27.56 57.38,27.56 IC24.9 | v52.81,32.13 52.35,32.59 51.28,32.59 IC24.2 | IC23.2 64.08,45.54 64.85,44.78 64.85,38.68 62.1,35.94 61.49,35.94 58.75,33.2 58.75,32.28 58.6,32.13 56.31,32.13 v55.85,31.67
  Bottom 0.152: v33.3,17.96 36.65,17.96 38.79,20.09 49.3,20.09 49.45,19.94 50.06,19.94 50.37,20.24 50.37,21.46 v50.06,21.77 | v50.98,22.68 51.59,22.68 52.35,21.92 54.94,21.92 55.85,22.83 v55.85,26.49 55.85,27.56 52.81,30.61 52.81,31.67 | 52.81,31.67 v52.81,32.13 | 52.81,31.67 v55.85,31.67
N$39
  Top 0.152: IC24.4 51.28,30.15 51.74,30.15 52.65,29.24 52.65,28.47 52.5,28.32 50.22,28.32 49.91,28.02 49.91,27.25 50.22,26.95 53.57,26.95 56.77,30.15 57.38,30.15 IC24.11 57.53,30.3 58.14,30.3 60.43,32.59 60.43,34.42 61.65,35.64 63.47,35.64 66.07,38.23 66.07,43.71 67.89,45.54 IC23.13
N$40  (via drill 0.35)
  Top 0.152: v32.84,14.76 31.17,14.76 IC20.13 | IC24.6 51.28,27.71 v52.96,27.71 54.64,29.39 54.64,31.37 55.85,32.59 57.38,32.59 IC24.13 | v46.25,41.12 45.49,41.88 42.44,41.88 IC12.5
  Bottom 0.152: v32.84,14.76 32.84,16.28 32.54,16.59 32.54,19.33 34.52,21.31 34.52,25.43 40.31,31.22 49.45,31.22 | v52.96,27.71 49.45,31.22 | v46.25,41.12 50.98,36.4 50.98,32.74 49.45,31.22
N$41  (via drill 0.35)
  Top 0.152: v43.97,46 43.05,46.91 42.44,46.91 IC12.1 | IC12.4 42.44,43.26 43.66,43.26 v43.97,43.56 46.71,43.56 v46.86,43.41 | v33.45,11.1 33.45,15.06 32.54,15.98 31.17,15.98 IC20.12 | v47.47,12.32 47.02,12.78 46.86,12.78 46.71,12.93 46.71,15.21 46.86,15.37 50.52,15.37 51.74,16.59 60.43,16.59 v60.58,16.43 | v59.05,26.34 57.53,26.34 IC24.8 | v65.46,38.53 v65.46,41.43 | v64.54,30.91 64.54,29.39 v65,28.93 | v61.8,24.97 61.19,24.97 v60.58,24.36
  Bottom 0.152: v43.97,46 v43.97,43.56 | v33.45,11.1 46.25,11.1 v47.47,12.32 | v60.58,16.43 v60.58,24.36 60.58,24.82 v59.05,26.34 | v46.86,43.41 50.98,39.29 53.72,39.29 55.85,41.43 v65.46,41.43 | v65.46,38.53 65.46,31.83 v64.54,30.91 | v65,28.93 65,28.17 v61.8,24.97
N$42
  Top 0.152: IC24.5 51.28,28.93 50.83,28.93 49.91,29.85 49.91,30.61 50.06,30.76 52.81,30.76 54.48,32.44 54.48,35.18 55.85,36.55 55.85,38.99 57.38,40.51 57.38,64.14 IC2.9
N$43  (via drill 0.35)
  Top 0.152: v54.18,35.79 54.18,32.59 53.11,31.52 51.28,31.52 IC24.3 | v59.97,38.38 60.58,38.99 v60.58,44.93 | v56.01,48.9 56.01,49.81 55.09,50.72 55.09,63.98 54.94,64.14 IC2.8
  Bottom 0.152: v54.18,35.79 57.38,35.79 v59.97,38.38 | v60.58,44.93 60.58,46.61 58.29,48.9 v56.01,48.9
N$44  (via drill 0.35)
  Top 0.152: v49.61,33.05 50.52,33.96 51.28,33.96 IC24.1 | v48.84,51.79 48.84,54.53 47.47,55.91 43.97,55.91 41.83,58.04 41.83,63.83 42.14,64.14 IC2.3
  Bottom 0.152: v49.61,33.05 50.67,34.11 50.67,35.18 49.3,36.55 46.71,36.55 44.73,38.53 44.73,45.85 46.25,47.37 46.25,49.2 v48.84,51.79
N$45
  Bottom 0.152: SV3.1 11.96,32.89 13.94,34.87 13.94,35.94 18.82,40.82 19.28,40.82 20.5,42.04 27.81,42.04 34.21,48.44 34.21,52.25 36.5,54.53 36.5,59.56 39.55,62.61 39.55,64.14 IC2.2
N$46
  pour Bottom: 0.03,74.27 0.03,0.03 96.67,0.03 96.67,74.3 0.03,74.3
N$47  (via drill 0.35)
  Top 0.152: v59.82,32.89 58.45,31.52 57.53,31.52 IC24.12 | v59.82,37.31 61.19,38.68 61.19,44.93 63.02,46.76 63.47,46.76 IC23.1 | IC22.9 26.59,17.5 25.68,16.59 21.41,16.59 v21.26,16.74 | v18.67,19.33 18.21,19.79 17.14,19.79 16.84,19.48 14.55,19.48 v14.1,19.94 | v36.65,38.07 36.65,37.62 38.33,35.94 38.33,35.33 | 38.33,35.33 38.33,33.5 38.94,32.89 39.85,32.89 IC11.2 | v46.86,41.88 46.86,37.92 v44.27,35.33 | 38.33,35.33 v38.48,35.33
  Bottom 0.152: v59.82,37.31 59.82,35.18 | 59.82,35.18 v59.82,32.89 | v18.67,19.33 v21.26,16.74 | v14.1,19.94 14.71,20.55 14.71,32.44 16.38,34.11 16.38,37.01 18.67,39.29 20.04,39.29 21.26,40.51 24.76,40.51 25.53,39.75 34.98,39.75 v36.65,38.07 | 59.82,35.18 53.57,35.18 v46.86,41.88 | v38.48,35.33 v44.27,35.33
N$48
  Top 0.152: IC11.1 40,34.11 40,43.1 41.38,44.48 42.29,44.48 IC12.3
N$49  (via drill 0.35)
  Top 0.152: v43.36,24.51 43.05,24.82 43.05,30.15 41.68,31.52 40,31.52 IC11.3 | v40.92,22.07 40.31,21.46 v40.31,19.18 | v33.15,16.89 32.54,16.89 32.23,16.59 29.95,16.59 28.42,15.06 28.42,12.01 24.76,8.36 11.81,8.36 6.48,13.69 6.48,19.18 4.65,21.01 SV4.1
  Bottom 0.152: v40.92,22.07 v43.36,24.51 | v40.31,19.18 39.7,19.18 37.41,16.89 v33.15,16.89
N$51
  Top 0.152: IC13.13 63.32,14.15 51.89,14.15 51.28,13.54 48.08,13.54 IC14.1
N$52
  Top 0.152: IC14.2 48.08,14.76 51.13,14.76 51.74,15.37 62.41,15.37 62.86,15.82 63.63,15.82 IC13.12
N$53  (via drill 0.35)
  Top 0.152: IC7.15 77.19,46.61 79.63,46.61 IC7.14 | v50.22,15.98 48.08,15.98 IC14.3 | v62.1,17.04 63.63,17.04 IC13.11 | v81.61,28.02 81.61,27.56 81.31,27.25 81.31,17.5 78.1,14.3 78.1,12.78 74.75,9.42 72.01,9.42 S4.1
  Bottom 0.152: v50.22,15.98 58.45,15.98 61.95,12.47 | 61.95,12.47 63.93,10.49 70.79,10.49 71.86,9.42 S4.1 | v62.1,17.04 62.1,14.15 62.56,13.69 62.56,13.08 61.95,12.47 | IC7.14 79.63,40.82 78.71,39.9 78.71,30.91 v81.61,28.02
N$54  (via drill 0.35)
  Top 0.152: 68.35,17.2 65.46,17.2 64.39,18.26 63.78,18.26 IC13.10 | 68.35,17.2 69.88,17.2 IC13.4 | 67.13,28.32 67.74,28.32 68.35,28.93 IC9.10 | 67.13,28.32 64.69,28.32 62.86,30.15 62.41,30.15 IC9.4 62.26,30.15 61.65,30.15 60.43,28.93 60.43,26.8 59.36,25.73 53.72,25.73 51.28,23.29 48.39,23.29 46.71,21.62 46.71,17.96 | v40.16,17.96 39.4,18.72 39.4,21.46 37.41,23.44 37.41,28.93 35.43,30.91 33.3,30.91 33.15,30.76 32.38,30.76 31.62,31.52 28.27,31.52 IC8.3 | 46.71,17.96 47.32,17.96 47.93,17.35 IC14.4 | 46.71,17.96 v46.41,17.96 | v68.35,19.33 68.35,17.2 | v68.5,21.92 68.5,24.66 67.13,26.04 67.13,28.32
  Bottom 0.152: v46.41,17.96 v40.16,17.96 | v68.35,19.33 68.35,21.77 v68.5,21.92
N$55
  Top 0.152: IC14.5 48.08,18.57 51.13,18.57 51.74,19.18 62.41,19.18 62.86,19.63 63.63,19.63 IC13.9
N$56
  Top 0.152: IC14.6 48.08,19.94 51.28,19.94 51.74,20.4 63.17,20.4 63.63,20.85 IC13.8
N$57
  Top 0.152: IC19.5 13.49,29.24 9.07,33.66 9.07,35.94 9.83,36.7 15.93,36.7 16.54,36.09 17.3,36.09 18.97,37.77 | 18.97,37.77 19.89,38.68 19.89,42.34 21.87,44.32 22.33,44.32 IC15.3 | IC8.1 23.24,34.11 20.35,37.01 19.74,37.01 18.97,37.77
N$58  (via drill 0.35)
  Top 0.152: 19.43,12.32 19.28,12.47 19.28,15.06 19.58,15.37 23.55,15.37 25.22,13.69 25.22,13.23 IC22.5 | 19.43,12.32 19.89,11.86 20.65,11.86 21.41,12.62 21.41,13.08 IC22.2 | v9.83,24.82 11.66,26.64 13.94,26.64 IC19.7 | v12.42,13.23 12.73,13.23 13.64,12.32 19.43,12.32 | v13.03,38.53 17.3,42.8 18.67,42.8 21.41,45.54 22.33,45.54 IC15.2 | v11.81,34.57 12.73,33.66 16.38,33.66 17.3,32.74 18.67,32.74 18.97,32.44 21.26,32.44 21.56,32.74 28.12,32.74 IC8.2
  Bottom 0.152: v12.42,13.23 11.66,14 11.66,23.29 10.13,24.82 v9.83,24.82 7.24,27.41 7.24,28.32 5.71,29.85 4.8,29.85 2.36,32.28 2.36,33.5 3.12,34.26 5.87,34.26 6.48,33.66 10.9,33.66 v11.81,34.57 13.03,35.79 v13.03,38.53
N$59  (via drill 0.35)
  Top 0.152: 4.5,51.33 4.5,48.9 SV1.2 4.5,48.74 v7.09,46.15 | 4.5,51.33 4.5,53.77 SV1.4 | 4.5,51.33 SV1.3 | SV4.4 4.65,28.63 4.65,26.34 SV4.3 4.65,26.19 4.65,23.75 SV4.2 4.5,23.6 4.5,23.29 2.82,21.62 2.82,17.96 4.65,16.13 SV5.4 4.8,15.98 4.8,13.54 SV5.3 4.8,13.39 6.48,11.71 6.48,7.9 5.41,6.83 5.41,5 | 5.41,5 5.41,3.78 X1.1 | v33.91,41.12 33.6,41.43 31.17,41.43 30.71,41.88 30.71,45.24 29.64,46.3 27.36,46.3 27.2,46.15 27.2,44.02 27.97,43.26 28.42,43.26 IC15.13 | v35.74,41.12 37.87,43.26 38.33,43.26 IC16.13 38.48,43.26 38.94,43.26 39.7,42.49 39.7,35.64 38.63,34.57 38.63,33.66 38.79,33.5 41.07,33.5 41.22,33.35 41.22,32.28 41.07,32.13 38.79,32.13 38.63,31.98 38.63,31.22 38.94,30.91 41.83,30.91 42.75,30 42.75,22.38 44.27,20.85 44.27,12.62 41.68,10.03 41.68,4.09 | 41.68,4.09 37.87,4.09 36.96,5 S6.3 36.96,5.16 36.19,5.92 27.66,5.92 26.75,5 22.48,5 S1.3 22.33,5 5.41,5 | 41.68,4.09 44.73,4.09 45.49,4.85 48.39,4.85 S2.3 48.54,4.85 49.45,3.94 56.16,3.94 57.07,4.85 59.97,4.85 S3.3 59.97,5 60.88,5.92 67.74,5.92 68.66,5 71.86,5 S4.3 72.01,5 72.92,5.92 79.63,5.92 80.39,5.16 85.72,5.16 S5.3
  Bottom 0.152: v7.09,46.15 7.09,39.29 6.32,38.53 6.32,37.47 5.71,36.86 3.28,36.86 1.45,35.03 1.45,26.64 4.5,23.6 SV4.2 | v35.74,41.12 v33.91,41.12
N$60
  Top 0.152: IC17.1 59.05,13.39 61.04,13.39 61.8,12.62 70.94,12.62 71.86,13.54 71.86,26.64 70.33,28.17 70.33,32.74 69.57,33.5 62.86,33.5 62.41,33.96 IC9.1
N$61
  Top 0.152: IC17.2 59.05,14.76 62.26,14.76 62.71,15.21 65.61,15.21 66.83,14 71.09,14 71.55,14.45 71.55,22.53 70.03,24.05 70.03,31.67 68.96,32.74 68.5,32.74 IC9.13
N$63  (via drill 0.35)
  Top 0.152: 33.15,31.83 30.71,34.26 30.71,36.55 30.1,37.16 30.1,44.63 29.18,45.54 28.57,45.54 IC15.15 | 33.15,31.83 33.3,31.67 34.37,31.67 IC8.12 | v54.48,19.79 IC17.6 | 33.15,31.83 v32.69,31.37
  Bottom 0.152: v54.48,19.79 53.11,19.79 49.61,16.28 49.61,13.84 50.22,13.23 50.22,12.62 48.23,10.64 33.91,10.64 33.76,10.49 32.99,10.49 32.08,11.4 22.33,11.4 15.01,18.72 15.01,26.95 16.23,28.17 19.74,28.17 21.56,26.34 29.49,26.34 32.69,29.54 v32.69,31.37
N$64
  Top 0.152: IC16.3 32.23,44.63 31.78,44.63 31.01,45.39 31.01,47.52 32.08,48.59 40.16,48.59 40.46,48.29 51.43,48.29 52.81,46.91 IC18.1
N$65
  Top 0.152: IC18.2 52.81,45.54 49.91,45.54 49.45,45.09 46.56,45.09 43.97,47.68 34.52,47.68 32.69,45.85 32.38,45.85 IC16.2
N$66
  Top 0.152: IC18.4 52.81,43.1 50.37,43.1 49.61,43.87 47.32,43.87 46.1,45.09 41.22,45.09 40,43.87 34.67,43.87 34.21,43.41 32.38,43.41 IC16.4
N$67  (via drill 0.35)
  Top 0.152: v37.26,35.48 33.3,39.45 32.38,39.45 IC16.7 | v47.32,37.16 v45.19,35.03 | v49.3,37.16 49.3,37.62 50.67,38.99 50.67,41.12 51.28,41.73 52.81,41.73 IC18.5
  Bottom 0.152: v37.26,35.48 38.02,34.72 44.88,34.72 v45.19,35.03 | v49.3,37.16 v47.32,37.16
N$68  (via drill 0.35)
  Top 0.152: v39.7,23.29 39.7,18.87 40,18.57 41.68,18.57 IC14.10 | v44.12,27.71 44.12,28.63 44.27,28.78 44.27,31.98 43.97,32.28 43.97,34.72 43.66,35.03 43.66,35.64 v46.1,38.07 | v48.39,38.07 48.84,38.07 50.06,39.29 v50.06,42.04 | v51.28,40.82 52.5,40.82 52.81,40.51 IC18.6
  Bottom 0.152: v44.12,27.71 v39.7,23.29 | v48.39,38.07 v46.1,38.07 | v51.28,40.82 v50.06,42.04
N$69
  Top 0.152: IC8.13 34.37,32.74 35.43,32.74 37.72,30.45 37.72,26.19 42.14,21.77 42.9,21.77 43.05,21.62 43.05,15.52 42.29,14.76 41.83,14.76 IC14.13
N$70
  Top 0.152: IC14.11 41.68,17.2 41.22,17.2 38.63,14.61 38.63,11.4 36.96,9.73 S6.1
N$71  (via drill 0.35)
  Top 0.152: v33.91,45.69 38.33,45.69 IC16.15 | v26.9,40.97 26.9,37.92 29.03,35.79 v29.79,35.79 | v32.08,34.72 32.08,33.35 33.3,32.13 35.59,32.13 36.04,31.67 v36.04,31.22 | v32.69,20.4 32.69,19.48 34.06,18.11 34.06,10.19 35.74,8.51 38.18,8.51 40.46,10.8 40.46,15.06 41.38,15.98 41.68,15.98 IC14.12
  Bottom 0.152: v33.91,45.69 31.93,45.69 27.2,40.97 v26.9,40.97 | v29.79,35.79 31.01,35.79 v32.08,34.72 | v36.04,31.22 36.04,27.86 32.69,24.51 v32.69,20.4
N$72  (via drill 0.35)
  Top 0.152: v21.56,21.16 21.56,19.33 IC22.13 | 20.8,24.82 20.19,25.43 IC19.9 | 20.8,24.82 v21.56,24.05 | v20.5,38.84 20.5,41.73 21.87,43.1 22.33,43.1 IC15.4 | v18.21,36.09 17.75,36.09 17.45,35.79 15.32,35.79 v15.01,36.09 | v14.1,21.01 14.4,21.01 14.71,20.7 16.69,20.7 20.8,24.82
  Bottom 0.152: v21.56,24.05 v21.56,21.16 | v20.5,38.84 18.21,36.55 v18.21,36.09 | v15.01,36.09 15.01,33.2 14.1,32.28 v14.1,21.01
N$73  (via drill 0.35)
  Top 0.152: v17.3,17.81 17.14,17.65 15.77,17.65 IC21.4 | v17.14,26.8 18.21,27.86 20.04,27.86 IC19.11 20.19,28.02 20.35,28.17 v21.72,28.17 | v20.19,37.62 21.87,39.29 22.33,39.29 IC15.7 | v29.49,19.79 31.17,19.79 IC20.9
  Bottom 0.152: v17.14,26.8 17.14,18.87 17.3,18.72 v17.3,17.81 18.97,16.13 21.56,16.13 25.22,19.79 v29.49,19.79 | v20.19,37.62 20.19,37.01 17.6,34.42 17.6,31.52 20.95,28.17 v21.72,28.17
N$74
  Top 0.152: IC8.11 31.17,30.3 30.4,31.06 29.49,31.06 29.34,30.91 25.22,30.91 24.46,31.67 20.19,31.67 IC19.14
N$75  (via drill 0.35)
  Top 0.152: v13.94,12.93 14.71,13.69 15.62,13.69 IC21.1 | 13.33,16.89 13.33,18.42 13.79,18.87 15.62,18.87 IC21.5 | v12.27,27.25 12.88,27.86 13.94,27.86 IC19.6 | 13.33,16.89 14.55,15.67 18.82,15.67 20.5,17.35 22.48,17.35 23.39,18.26 23.39,20.4 24.31,21.31 28.12,21.31 28.88,20.55 28.88,19.48 29.79,18.57 31.17,18.57 IC20.10 | 13.33,16.89 v13.33,16.59
  Bottom 0.152: v13.94,12.93 13.33,13.54 v13.33,16.59 12.27,17.65 v12.27,27.25
N$76  (via drill 0.35)
  Top 0.152: v59.82,27.1 59.82,29.54 61.8,31.52 62.26,31.52 IC9.3 | IC4.14 79.63,21.62 77.34,21.62 IC4.15
  Bottom 0.152: v59.82,27.1 59.82,26.04 61.8,24.05 61.8,23.44 62.71,22.53 71.7,22.53 74.29,19.94 | 74.29,19.94 75.67,19.94 77.19,21.46 IC4.15 | 74.29,19.94 73.69,19.33 73.69,12.93 73.84,12.78 73.84,8.97 72.62,7.75 28.42,7.75 26.75,9.42 22.48,9.42 S1.1
N$77
  Top 0.152: 12.73,15.67 14.1,15.67 14.71,15.06 15.62,15.06 IC21.2 | 12.73,15.67 8.46,15.67 8.31,15.52 8.31,13.23 9.98,11.56 22.94,11.56 24,12.62 24,13.08 IC22.4 | 12.73,15.67 12.73,20.55 18.82,26.64 20.04,26.64 IC19.10
N$78
  Top 0.152: IC20.1 37.26,13.54 35.28,13.54 34.37,14.45 34.37,19.63 31.01,22.99 22.48,22.99 20.8,21.31 20.8,18.11 19.28,16.59 15.93,16.59 15.77,16.43 IC21.3
N$79  (via drill 0.35)
  Top 0.152: IC20.4 37.41,17.2 37.87,17.2 38.63,16.43 38.63,15.52 37.87,14.76 37.41,14.76 IC20.2 37.26,14.61 v35.13,14.61 | 20.65,14 21.11,14.45 22.02,14.45 22.78,13.69 IC22.3 | 20.65,14 20.35,13.69 20.35,13.23 IC22.1 | IC19.12 18.67,29.24 16.54,27.1 v16.54,25.27 | 20.65,14 v19.89,14.76
  Bottom 0.152: v16.54,25.27 16.54,17.65 19.43,14.76 v19.89,14.76 20.8,14.76 23.85,17.81 25.68,17.81 27.2,16.28 27.2,15.06 29.03,13.23 33.15,13.23 34.52,14.61 v35.13,14.61
N$80
  Top 0.152: SV2.1 6.32,56.06 11.05,56.06 16.08,51.03 20.5,51.03 25.07,46.46 25.07,37.77 26.59,36.25 27.81,36.25 29.49,34.57 29.49,33.66 29.34,33.5 27.05,33.5 26.9,33.66 17.6,33.66 15.77,35.48 14.55,35.48 13.94,36.09 9.68,36.09 9.37,35.79 9.37,34.11 12.88,30.61 13.94,30.61 IC19.4
N$81  (via drill 0.35)
  Top 0.152: v8.15,28.32 8.15,24.05 9.52,22.68 9.52,21.46 IC21.8 | v4.95,31.52 3.58,31.52 2.51,32.59 2.51,37.31 v2.06,37.77 | v5.56,44.93 8,44.93 v8.31,45.24 | v8.31,56.67 4.5,60.48 SV2.2
  Bottom 0.152: v4.95,31.52 v8.15,28.32 | v2.06,37.77 2.06,41.43 v5.56,44.93 | v8.31,56.67 v8.31,45.24
N$82  (via drill 0.35)
  Top 0.152: v35.74,20.85 36.65,19.94 37.26,19.94 IC20.6 | v43.66,29.08 43.66,34.57 43.36,34.87 43.36,38.38 v43.51,38.53 | v40.46,54.99 40,54.99 39.55,55.45 21.87,55.45 19.28,58.04 14.1,58.04 9.22,62.92 4.5,62.92 SV2.3
  Bottom 0.152: v35.74,20.85 35.74,21.16 v43.66,29.08 | v43.51,38.53 43.51,40.21 37.11,46.61 37.11,52.55 39.55,54.99 v40.46,54.99
N$83  (via drill 0.35)
  Top 0.152: v22.78,22.38 IC22.12 | v15.62,25.43 14.1,23.9 v10.13,23.9 | v6.93,38.23 6.93,41.43 2.21,46.15 v2.21,47.22
  Bottom 0.152: v22.78,22.38 22.78,23.9 18.82,27.86 16.38,27.86 15.62,27.1 v15.62,25.43 | v10.13,23.9 9.22,23.9 9.07,23.75 6.78,23.75 5.41,25.12 3.43,25.12 2.82,25.73 2.82,27.86 2.21,28.47 2.21,31.22 1.75,31.67 1.75,34.87 3.43,36.55 5.87,36.55 6.93,37.62 v6.93,38.23 | v2.21,47.22 2.21,63.37 SV2.4
N$84
  Top 0.152: IC20.5 37.26,18.57 35.89,18.57 31.17,23.29 20.19,23.29 17.14,20.24 15.77,20.24 IC21.6
N$85
  Top 0.152: IC22.6 26.59,12.78 25.07,11.25 9.83,11.25 7.09,14 7.09,18.57 8.61,20.09 9.52,20.09 IC21.9
N$86  (via drill 0.35)
  Top 0.152: v12.88,21.62 12.88,21.31 10.44,18.87 9.68,18.87 IC21.10 | v14.1,18.26 16.84,18.26 v17.75,19.18 | v29.49,20.7 30.86,20.7 31.17,21.01 IC20.8
  Bottom 0.152: v12.88,21.62 12.88,19.48 v14.1,18.26 | v17.75,19.18 18.06,19.48 18.06,19.63 18.67,20.24 29.03,20.24 v29.49,20.7
N$87  (via drill 0.35)
  Top 0.152: v33.91,22.68 33.91,21.46 36.19,19.18 38.48,19.18 38.63,19.02 38.63,18.11 38.48,17.96 36.19,17.96 36.04,17.81 36.04,16.74 36.65,16.13 37.26,16.13 IC20.3 | v24.46,39.9 24.46,46.61 23.55,47.52 20.95,47.52 19.28,45.85 7.7,45.85 7.39,45.54 5.11,45.54 4.5,46.15 SV1.1
  Bottom 0.152: v33.91,22.68 33.91,25.27 40.61,31.98 44.88,31.98 45.19,32.28 45.19,32.89 44.27,33.81 36.19,33.81 30.56,39.45 24.92,39.45 v24.46,39.9
N$88  (via drill 0.35)
  Top 0.152: v67.44,44.17 69.72,44.17 IC23.12 | v45.34,47.37 v46.56,46.15 | v44.58,50.11 43.66,50.11 43.51,49.96 40.16,49.96 39.55,50.57 39.55,52.4 37.41,54.53 26.29,54.53 23.7,51.94 23.7,50.42 v22.94,49.66 | v20.95,49.66 20.04,49.66 19.28,50.42 10.13,50.42 5.56,54.99 3.28,54.99 1.6,53.31 1.6,46 4.5,43.1 4.5,40.51 SV3.4
  Bottom 0.152: v67.44,44.17 61.19,44.17 61.04,44.02 59.05,44.02 56.92,46.15 v46.56,46.15 | v45.34,47.37 45.34,49.35 v44.58,50.11 | v20.95,49.66 v22.94,49.66
N$89  (via drill 0.35)
  Top 0.152: v42.14,29.08 40,29.08 IC11.5 | v53.72,22.53 54.64,22.53 v55.24,23.14 | v55.24,27.25 56.31,28.32 58.6,28.32 59.51,29.24 59.51,30.3 v60.43,31.22 | v56.77,36.4 v60.43,36.4 | v45.34,41.12 44.42,41.12 44.27,41.28 42.9,41.28 IC12.6
  Bottom 0.152: v42.14,29.08 43.05,30 44.58,30 51.59,22.99 51.74,22.99 52.2,22.53 v53.72,22.53 | v55.24,27.25 v55.24,23.14 | v60.43,36.4 v60.43,31.22 | v56.77,36.4 53.42,36.4 47.17,42.65 46.56,42.65 45.34,41.43 v45.34,41.12
N$90  (via drill 0.35)
  Top 0.152: v38.33,27.41 38.63,27.71 39.85,27.71 IC11.6 | v35.13,24.82 32.84,24.82 29.18,28.47 27.05,28.47 24.61,30.91 24.61,31.06 24.31,31.37 21.41,31.37 21.26,31.22 16.23,31.22 15.01,32.44 12.42,32.44 v10.59,34.26
  Bottom 0.152: v38.33,27.41 37.72,27.41 v35.13,24.82 | v10.59,34.26 10.29,34.26 7.7,36.86 7.7,46.46 7.39,46.76 6.78,46.76 6.48,46.46 6.48,39.9 4.65,38.07 SV3.3
N$91  (via drill 0.35)
  Top 0.152: v7.7,14.3 7.7,15.37 8.61,16.28 9.52,16.28 IC21.12 | v10.74,10.34 21.11,10.34 21.41,10.64 25.83,10.64 27.2,12.01 27.2,14.45 v26.29,15.37 | v24.46,17.2 24.46,17.96 24.76,18.26 24.76,20.55 24.92,20.7 26.9,20.7 27.81,19.79 27.81,19.33 IC22.8
  Bottom 0.152: v7.7,14.3 7.7,13.39 v10.74,10.34 | v24.46,17.2 v26.29,15.37
N$92
  Top 0.152: IC21.13 9.68,14.91 14.1,14.91 14.55,14.45 18.21,14.45 19.74,15.98 28.88,15.98 30.1,17.2 31.17,17.2 IC20.11
N$93  (via drill 0.35)
  Top 0.152: IC12.2 42.29,45.69 41.38,45.69 40.92,45.24 35.59,45.24 34.21,43.87 31.17,43.87 31.01,43.71 31.01,42.8 31.17,42.65 33.3,42.65 35.74,40.21 35.74,38.07 37.87,35.94 37.87,31.52 39.09,30.3 IC11.4 v41.53,30.3 | v25.37,17.2 25.37,19.33 IC22.10 | v45.34,12.32 45.34,20.7 v50.06,25.43 50.37,25.73 53.26,25.73 54.64,27.1 54.64,27.56 55.85,28.78 57.38,28.78 IC24.10
  Bottom 0.152: v25.37,17.2 26.9,15.67 26.9,14.15 29.34,11.71 44.73,11.71 v45.34,12.32 | v41.53,30.3 45.19,30.3 v50.06,25.43
N$94  (via drill 0.35)
  Top 0.152: v8.76,24.36 10.9,22.23 10.9,19.79 10.59,19.48 8.46,19.48 8.31,19.33 8.31,18.42 9.07,17.65 9.52,17.65 IC21.11
  Bottom 0.152: v8.76,24.36 5.41,27.71 3.43,27.71 2.51,28.63 2.51,31.37 2.06,31.83 2.06,33.66 3.73,35.33 4.5,35.33 SV3.2
VCC  (via drill 0.35)
  Top 0.152: IC1.16 32.99,59.26 35.43,59.26 IC1.15 | IC2.15 IC2.16 | IC3.16 79.48,71.76 81.76,71.76 IC3.15 | 59.05,46.91 61.95,46.91 62.41,47.37 69.27,47.37 69.72,46.91 | v78.1,48.74 71.55,48.74 71.4,48.59 | 69.72,46.91 71.4,48.59 | 69.72,46.91 IC23.14 | v51.74,69.16 56.16,69.16 57.23,68.1 60.27,68.1 v60.58,68.4 | v70.64,60.93 70.64,58.95 71.4,58.19 71.4,48.59 | 51.28,46.3 49.61,46.3 49,46.91 48.54,46.91 IC12.14 | 51.28,46.3 53.87,46.3 54.18,46 54.18,42.65 54.03,42.49 51.59,42.49 50.37,41.28 50.37,39.14 46.25,35.03 46.25,34.11 IC11.14 45.64,34.11 44.58,33.05 v44.58,32.59 | v13.94,14.15 13.64,13.84 9.68,13.84 IC21.14 | v14.1,17.2 14.4,17.2 14.71,16.89 17.75,16.89 20.19,19.33 IC22.14 | v24,30.76 23.55,30.3 23.55,28.47 IC10.5 | v32.84,33.5 33.76,33.5 IC8.14 | v32.84,13.84 32.54,13.54 31.17,13.54 IC20.14 31.17,13.39 30.71,13.39 v25.68,8.36 | v49.61,12.93 51.13,12.93 51.59,13.39 52.81,13.39 IC17.14 | 59.05,46.91 58.29,47.68 v58.29,47.83 | 51.28,46.3 v51.28,47.07 | 59.05,46.91 IC18.14
  Bottom 0.152: IC1.15 35.59,59.26 35.59,60.63 38.79,63.83 38.79,65.2 43.66,70.08 45.49,70.08 47.17,71.76 IC2.16 | v78.1,48.74 80.09,50.72 80.09,52.1 83.44,55.45 86.79,55.45 87.86,56.52 87.86,65.2 81.91,71.15 81.91,71.6 IC3.15 | v51.74,69.16 49.91,70.99 49.91,71.76 IC2.15 | v60.58,68.4 61.04,68.4 67.74,61.7 69.88,61.7 v70.64,60.93 | v14.1,17.2 13.94,17.04 v13.94,14.15 15.47,14.15 21.26,8.36 v25.68,8.36 | v24,30.76 30.1,30.76 32.23,32.89 | v32.84,33.5 32.23,32.89 | 33.3,31.83 33.3,25.88 32.08,24.66 32.08,14.61 v32.84,13.84 34.21,15.21 35.43,15.21 37.72,12.93 v49.61,12.93 | 32.23,32.89 33.3,31.83 | v44.58,32.59 34.06,32.59 33.3,31.83 | v58.29,47.83 52.04,47.83 v51.28,47.07
VDD  (via drill 0.35)
  Top 0.152: v15.62,34.26 13.94,34.26 IC19.1 | v25.98,41.43 25.98,45.39 27.51,46.91 28.42,46.91 IC15.16 | v36.19,47.07 38.33,47.07 IC16.16 | IC6.16 74.14,59.26 74.14,58.04 78.87,53.31 79.63,53.31 80.39,52.55 80.39,47.68 80.54,47.52 80.54,45.39 80.09,44.93 76.12,44.93 74.6,46.46 IC7.16 | v43.66,13.54 41.83,13.54 IC14.14 | v54.03,31.06 54.03,31.22 56.77,33.96 57.38,33.96 IC24.14 | v61.95,13.39 63.63,13.39 IC13.14 | 73.69,24.66 73.69,22.53 74.6,21.62 IC4.16 | 73.69,24.66 73.69,31.52 71.25,33.96 68.5,33.96 IC9.14 | 73.69,24.66 80.24,24.66 80.7,25.12 80.7,27.25 74.75,33.2 74.75,33.81 IC5.16 | v51.74,34.87 v50.06,34.87
  Bottom 0.152: v15.62,34.26 15.62,37.16 18.97,40.51 20.35,40.51 21.26,41.43 v25.98,41.43 25.98,40.97 26.59,40.36 29.49,40.36 35.13,46 | 35.13,46 v36.19,47.07 | IC5.16 74.75,33.96 74.75,37.01 75.51,37.77 75.51,45.54 74.6,46.46 IC7.16 | v43.66,13.54 46.41,13.54 53.42,20.55 54.79,20.55 | 54.79,20.55 58.45,24.21 58.45,26.64 | 58.45,26.64 61.34,29.54 71.25,29.54 73.69,27.1 73.69,22.53 74.6,21.62 IC4.16 | 58.45,26.64 55.09,30 | 55.09,30 v54.03,31.06 | 54.79,20.55 v61.95,13.39 | 35.13,46 46.25,34.87 v50.06,34.87 | v51.74,34.87 54.33,32.28 56.16,32.28 56.46,31.98 56.46,31.37 55.09,30
VSS  (via drill 0.35)
  Top 0.152: IC4.8 92.58,14 92.58,19.63 93.34,20.4 93.34,25.43 92.58,26.19 IC5.8 92.58,26.34 92.58,31.98 93.5,32.89 93.5,37.77 92.43,38.84 IC7.8 92.28,38.99 92.28,44.48 91.36,45.39 91.36,51.18 91.82,51.64 IC6.8 | IC14.7 48.08,21.16 50.52,21.16 v54.33,24.97 54.79,25.43 61.34,25.43 62.26,26.34 IC9.7 62.41,26.34 62.86,26.34 68.2,21.01 | v52.96,26.34 51.28,26.34 IC24.7 | 68.2,21.01 69.88,21.01 IC13.7 | IC19.8 14.4,25.43 15.93,26.95 v15.93,30.15 | v19.43,35.18 v16.99,35.18 | v21.41,37.16 22.33,38.07 IC15.8 22.48,37.92 22.63,37.77 v24,37.77 | v30.71,37.92 30.86,38.07 32.23,38.07 IC16.8 35.74,34.72 35.74,33.2 38.33,30.61 v38.33,28.32 | v73.99,7.75 70.03,7.75 69.72,8.05 v69.72,11.4 | 68.2,21.01 v67.74,20.55
  Bottom 0.152: v54.33,24.97 v52.96,26.34 49.61,26.34 45.03,30.91 40.92,30.91 v38.33,28.32 | v15.93,30.15 15.93,33.2 16.99,34.26 v16.99,35.18 | v21.41,37.16 v19.43,35.18 | v30.71,37.92 26.14,37.92 25.98,37.77 v24,37.77 | v73.99,7.75 76.89,10.64 88.62,10.64 91.82,13.84 92.43,13.84 IC4.8 | v69.72,11.4 69.72,17.04 67.74,19.02 v67.74,20.55

## Text on the board
tNames: TIME LEFT | VOTES | WINNER | MADE BY - / MEHUL KUMAR / SAHOO | C:/Users/sahoo/OneDrive/Pictures/EES.bmp | START | C1 | C2 | C3 | C4 | COUNT | START | START
bNames: MADE BY - / MEHUL KUMAR SAHOO